# Altium schematic sheet Analog_Input.SchDoc
size A
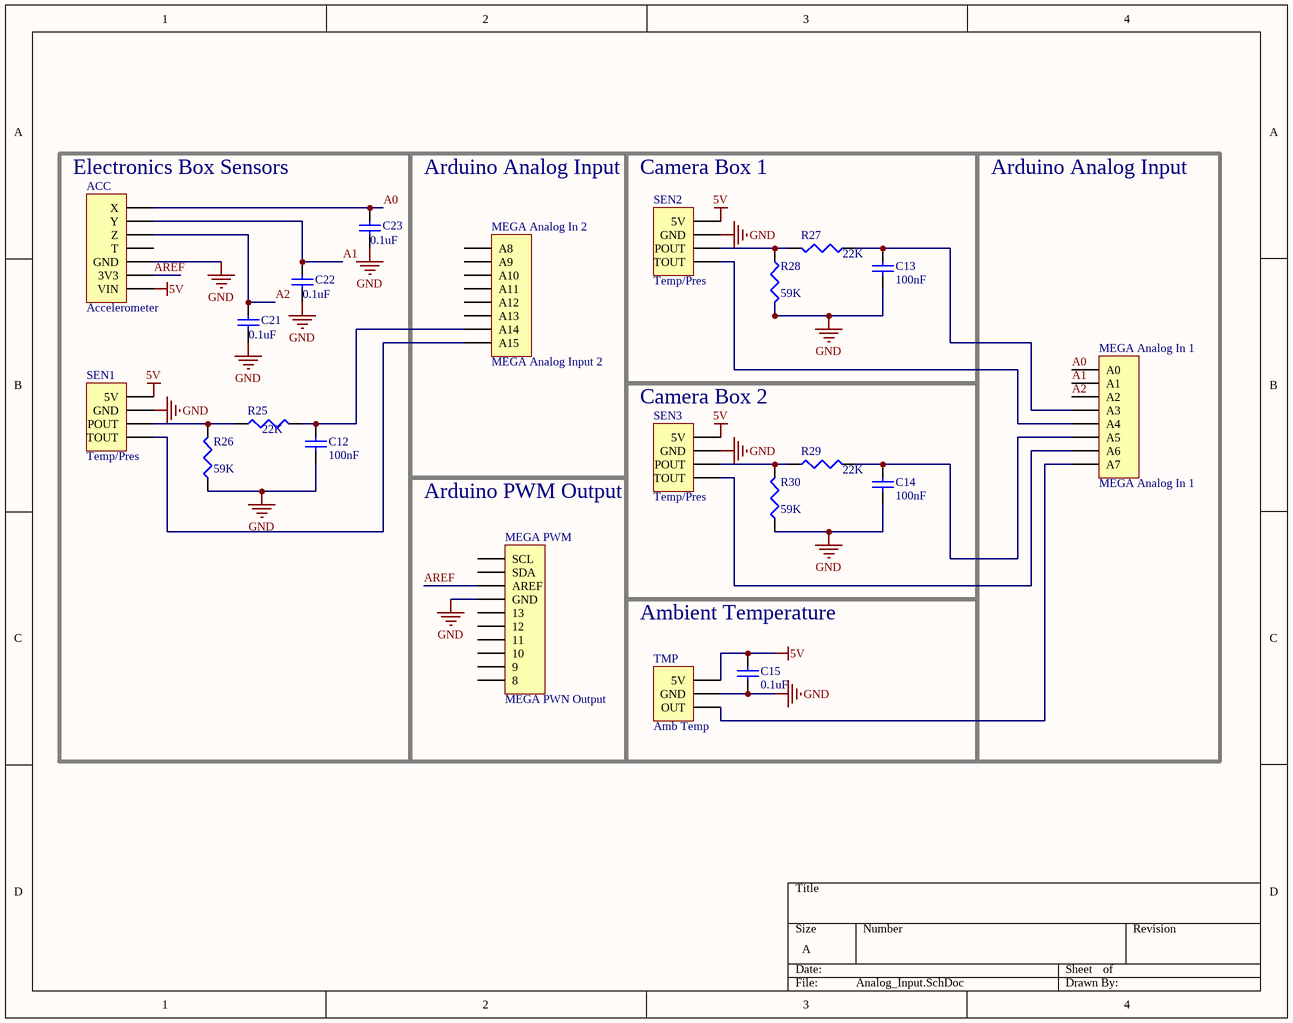
[diagram p0: Analog_Input.SchDoc]

## Parts
ACC  Accelerometer  [HDR1X7]
C12  100nF  [C1206]
C13  100nF  [C1206]
C14  100nF  [C1206]
C15  0.1uF  [C1206]
C21  0.1uF  [C1206]
C22  0.1uF  [C1206]
C23  0.1uF  [C1206]
MEGA_Analog_In_1  MEGA Analog In 1  [HDR1X8]
MEGA_Analog_In_2  MEGA Analog Input 2  [HDR1X8]
MEGA_PWM  MEGA PWN Output  [HDR1X10]
R25  22K  [J1-0603]
R26  59K  [J1-0603]
R27  22K  [J1-0603]
R28  59K  [J1-0603]
R29  22K  [J1-0603]
R30  59K  [J1-0603]
SEN1  Temp/Pres  [HDR1X4]
SEN2  Temp/Pres  [HDR1X4]
SEN3  Temp/Pres  [HDR1X4]
TMP  Amb Temp  [HDR1X3]

## Blocks framed on the sheet
Electronics Box Sensors: ACC C12 C21-C23 R25 R26 SEN1
Arduino Analog Input: MEGA_Analog_In_2
Camera Box 1: C13 R27 R28 SEN2
Arduino Analog Input: MEGA_Analog_In_1
Camera Box 2: C14 R29 R30 SEN3
Arduino PWM Output: MEGA_PWM
Ambient Temperature: C15 TMP

## Nets
5V: ACC.1(VIN) C15.1 SEN1.1(5V) SEN2.1(5V) SEN3.1(5V) TMP.1(5V)
GND: ACC.3(GND) C12.1 C13.1 C14.1 C15.2 C21.1 C22.1 C23.1 MEGA_PWM.4(GND) R26.1 R28.2 R30.1 SEN1.2(GND) SEN2.2(GND) SEN3.2(GND) TMP.2(GND)
A0: ACC.7(X) C23.2 MEGA_Analog_In_1.1(A0)
A1: ACC.6(Y) C22.2 MEGA_Analog_In_1.2(A1)
A2: ACC.5(Z) C21.2 MEGA_Analog_In_1.3(A2)
AREF: ACC.2(3V3) MEGA_PWM.3(AREF)
NetC12_2: C12.2 MEGA_Analog_In_2.7(A14) R25.2
NetC13_2: C13.2 MEGA_Analog_In_1.4(A3) R27.1
NetC14_2: C14.2 MEGA_Analog_In_1.6(A5) R29.2
NetMEGA_Analog_In_1_5: MEGA_Analog_In_1.5(A4) SEN2.4(TOUT)
NetMEGA_Analog_In_1_7: MEGA_Analog_In_1.7(A6) SEN3.4(TOUT)
NetMEGA_Analog_In_1_8: MEGA_Analog_In_1.8(A7) TMP.3(OUT)
NetMEGA_Analog_In_2_8: MEGA_Analog_In_2.8(A15) SEN1.4(TOUT)
NetR25_1: R25.1 R26.2 SEN1.3(POUT)
NetR27_2: R27.2 R28.1 SEN2.3(POUT)
NetR29_1: R29.1 R30.2 SEN3.3(POUT)

Not connected (* = marked no-connect by the designer): ACC 4(T); MEGA_Analog_In_2 1(A8) 2(A9) 3(A10) 4(A11) 5(A12) 6(A13); MEGA_PWM 1(SCL) 2(SDA) 5(13) 6(12) 7(11) 8(10) 9 10(8)

## Library data of the parts
ACC = Header 7: Header, 7-Pin; LatestRevisionDate: 17-Jul-2002; LatestRevisionNote: Re-released for DXP Platform.; Publisher: Altium Limited
C12-C15 C21-C23 = Cap Semi: Capacitor (Semiconductor SIM Model); Published: 8-Jun-2000; LatestRevisionDate: 29-May-2009; LatestRevisionNote: IPC-7351 Footprint Added.; PackageReference: C1206; Publisher: Altium Limited; PackageDescription: Chip Capacitor
  C12-C14: Value: 100nF
  C15 C21-C23: Value: 0.1uF
MEGA_Analog_In_1 MEGA_Analog_In_2 = Header 8: Header, 8-Pin; LatestRevisionDate: 17-Jul-2002; LatestRevisionNote: Re-released for DXP Platform.; Publisher: Altium Limited
MEGA_PWM = Header 10: Header, 10-Pin; LatestRevisionDate: 17-Jul-2002; LatestRevisionNote: Re-released for DXP Platform.; Publisher: Altium Limited
R25-R30 = Res3: Resistor; Published: 8-Jun-2000; LatestRevisionDate: 29-May-2009; LatestRevisionNote: IPC-7351 Footprint Added.; PackageReference: J1-0603; Publisher: Altium Limited; PackageDescription: Chip Resistor
  R25 R27 R29: Value: 22K
  R26 R28 R30: Value: 59K
SEN1-SEN3 = Header 4: Header, 4-Pin; LatestRevisionDate: 17-Jul-2002; LatestRevisionNote: Re-released for DXP Platform.; Publisher: Altium Limited
TMP = Header 3: Header, 3-Pin; LatestRevisionDate: 17-Jul-2002; LatestRevisionNote: Re-released for DXP Platform.; Publisher: Altium Limited